# EAGLE design carte imprimante2 (EAGLE 6.1)
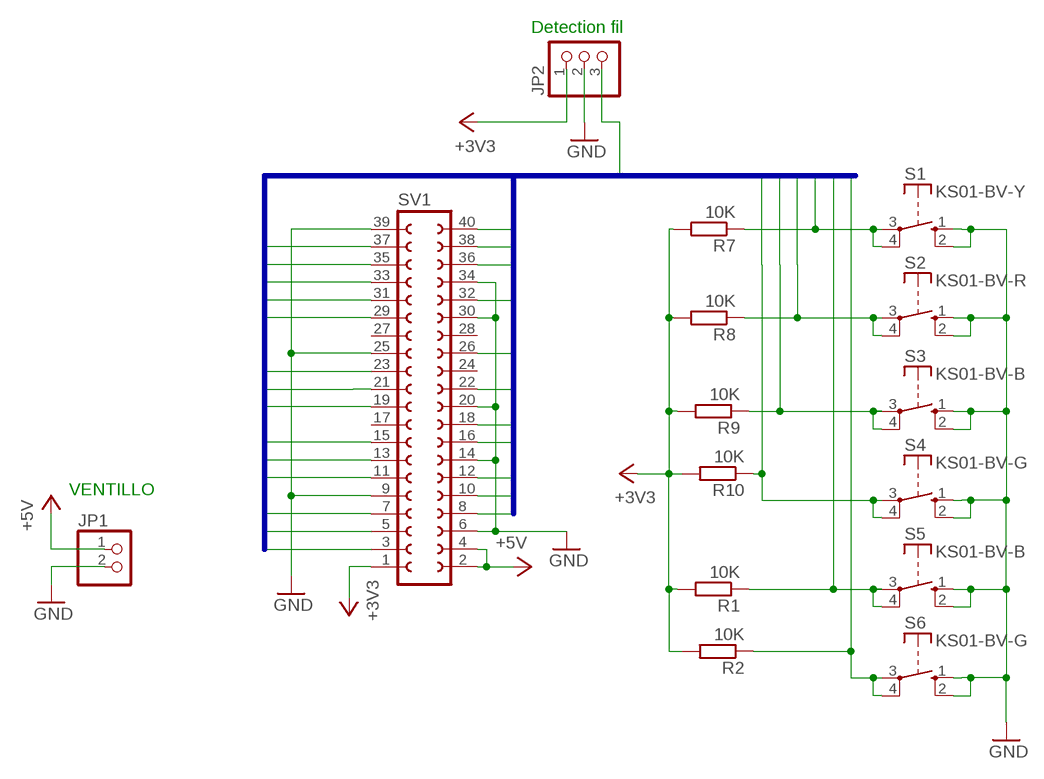
[diagram p0: schematic, sheet 1]

## Parts
JP1  PINHD-1X02_2.54-S  [1X02-S]
JP2  PINHD-1X3  [1X03]
R1  10K  R-EU_R0603  [R0603]
R2  10K  R-EU_R0603  [R0603]
R7  10K  R-EU_R0603  [R0603]
R8  10K  R-EU_R0603  [R0603]
R9  10K  R-EU_R0603  [R0603]
R10  10K  R-EU_R0603  [R0603]
S1  KS01-BV-Y  DT6  [DT6]
S2  KS01-BV-R  DT6  [DT6]
S3  KS01-BV-B  DT6  [DT6]
S4  KS01-BV-G  DT6  [DT6]
S5  KS01-BV-B  DT6  [DT6]
S6  KS01-BV-G  DT6  [DT6]
SV1  FE20-2  [FE20-2]

## Nets
+3V3: JP2.1 R1.2 R2.2 R7.2 R8.2 R9.2 R10.2 SV1.1
+5V: JP1.1 SV1.2 SV1.4
GND: JP1.2 JP2.2 S1.1(S) S1.2(S) S2.1(S) S2.2(S) S3.1(S) S3.2(S) S4.1(S) S4.2(S) S5.1(S) S5.2(S) S6.1(S) S6.2(S) SV1.6 SV1.9 SV1.14 SV1.20 SV1.25 SV1.30 SV1.34 SV1.39
GPIO2*: SV1.3
GPIO3*: SV1.5
GPIO4: SV1.7
GPIO5: SV1.29
GPIO6: SV1.31
GPIO7*: SV1.26
GPIO9*: SV1.21
GPIO10*: R7.1 S1.3(P) S1.4(P) SV1.19
GPIO11*: SV1.23
GPIO12: SV1.32
GPIO13: SV1.33
GPIO14*: SV1.8
GPIO15*: SV1.10
GPIO16: SV1.36
GPIO17: R10.1 S4.3(P) S4.4(P) SV1.11
GPIO18: JP2.3 SV1.12
GPIO19: R1.1 S5.3(P) S5.4(P) SV1.35
GPIO20: SV1.38
GPIO21: SV1.40
GPIO22: R8.1 S2.3(P) S2.4(P) SV1.15
GPIO23: SV1.16
GPIO24: SV1.18
GPIO25: SV1.22
GPIO26: R2.1 S6.3(P) S6.4(P) SV1.37
GPIO27: R9.1 S3.3(P) S3.4(P) SV1.13
Unconnected: SV1.17 SV1.24 SV1.27 SV1.28

## Buses
GPIO4,GPIO14*,GPIO15*,GPIO17,GPIO18,GPIO27,GPIO22,GPIO23,GPIO24,GPIO10*,GPIO9*,GPIO25,GPIO11*,GPIO7*,ID_SD,ID_SC,GPIO5,GPIO6,GPIO13,GPIO19,GPIO26,GPIO2*,GPIO3*,GPIO21,GPIO20,GPIO16,GPIO12

## Notes on the sheet
- Detection fil
- VENTILLO

## Library data of the parts
JP1 = pinhead-2:PINHD-1X02: PIN HEADER
JP2 = pinhead:PINHD-1X3: PIN HEADER
R1 R2 R7-R10 = rcl:R-EU_: RESISTOR, European symbol
S1-S6 = switch-misc:DT: ITT SWITCH
SV1 = con-lsta:FE20-2: FEMALE HEADER

## Board
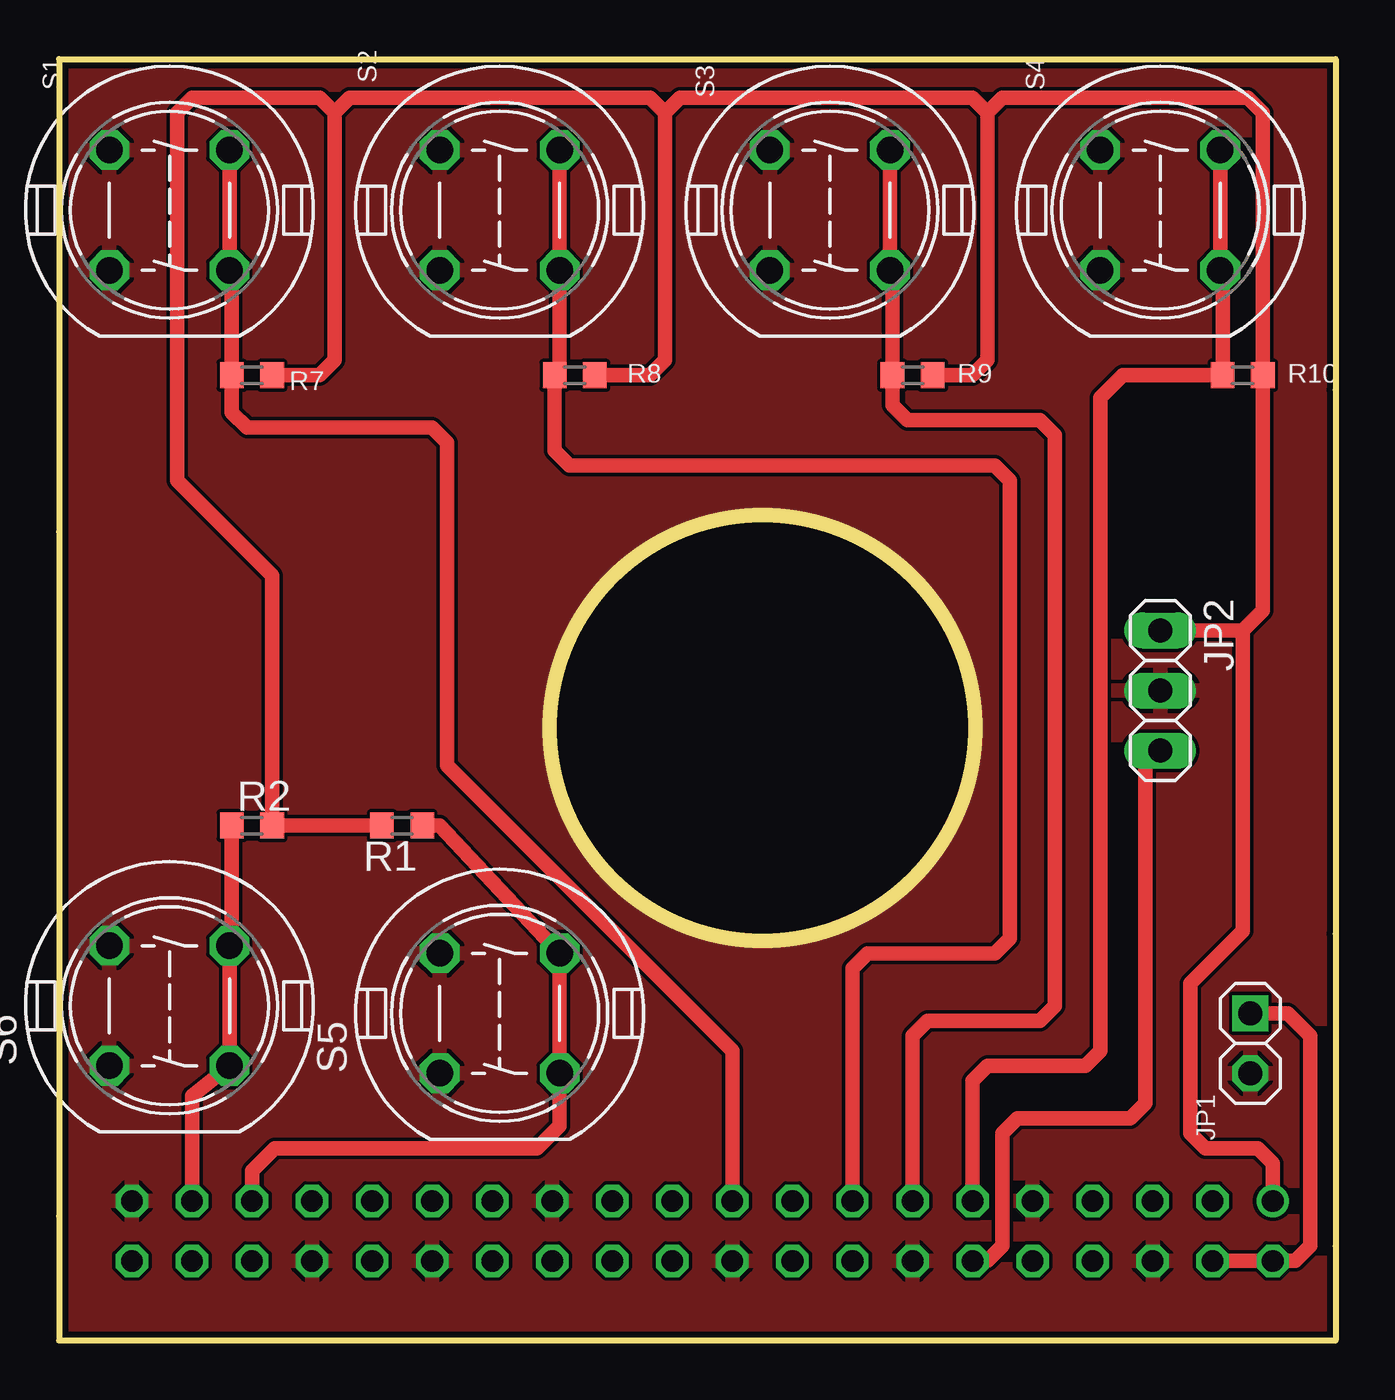
[diagram p1: board, top side]
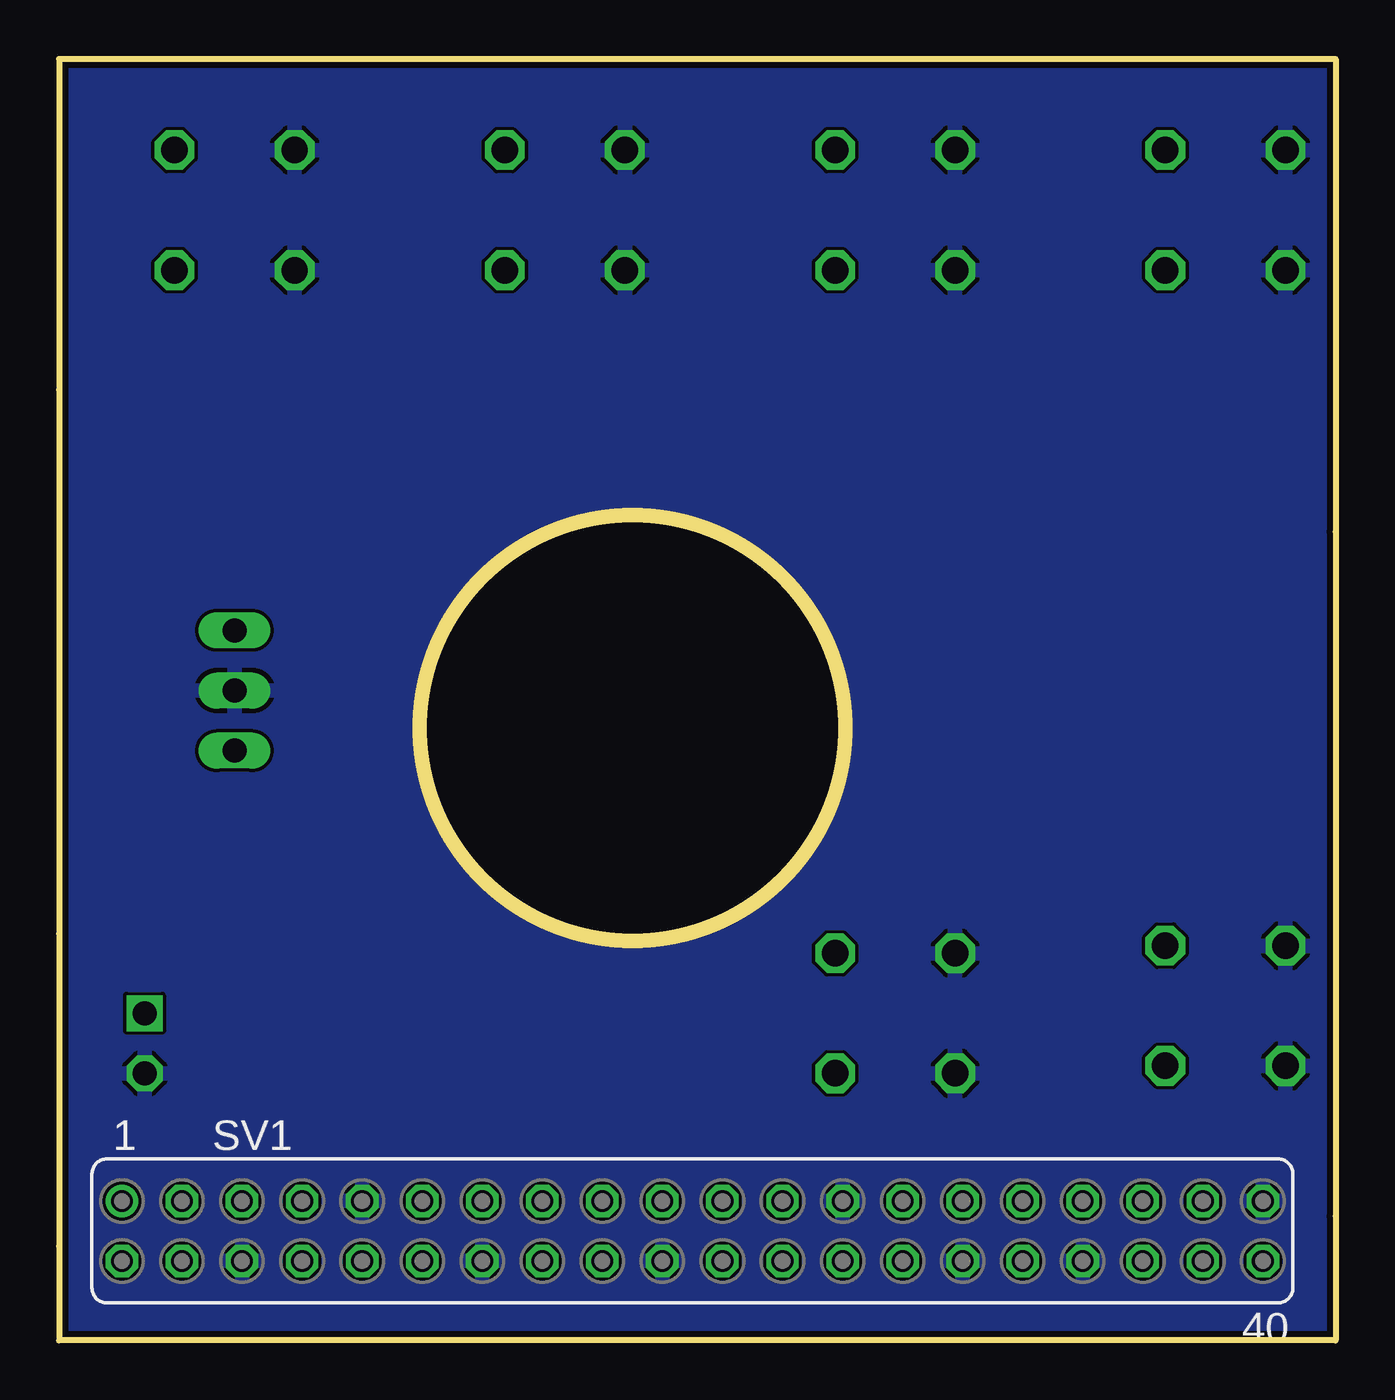
[diagram p2: board, bottom side, seen from below]

Size 54 x 54.2 mm. Coordinates in mm from the lower left corner, seen from the top.
Outline: 54,40.2 54,17.2 54,4 54,0 0,0 0,5.27 0,34.2 0,54.2 54,54.2 54,40.2
Copper layers (1*16): Top 0.018mm / dielectric 1.55mm / Bottom 0.018mm
Design rules: minimum track width 0.15mm, minimum drill 0.35mm, track to track 0.15mm, track to pad 0.15mm, pad to pad 0.15mm, via to via 0.15mm, smd to smd 0mil, copper to edge 0.25mm, drill to drill 0.35mm, minimum pad ring 0.175mm, minimum via ring 0.125mm, stop-mask expansion 0mil, vias tented up to drill 0.45mm, thermal gap 0.2mm
Holes 18 mm at 29.75,25.9
Milling: area 20.8,16.9 to 38.8,34.9; area 20.8,16.9 to 38.8,34.9

### Footprints (pad centres in the part's own frame; a part is rotated, then mirrored left to right if it is on the bottom)
1X02-S = drill 1.016 square: 1 -1.27,0 | drill 1.016 octagon: 2 1.27,0
1X03 = drill 1.016 long: 1 -2.54,0; 2 0,0; 3 2.54,0
R0603 = smd 1 x 1.1: 1 -0.85,0; 2 0.85,0
DT6 = drill 1.118 octagon: 1 -2.54,2.54; 2 2.54,2.54; 3 2.54,-2.54; 4 -2.54,-2.54
FE20-2 = drill 0.914: 1 -24.13,1.27 | drill 0.914 octagon: 2 -24.13,-1.27; 3 -21.59,1.27; 4 -21.59,-1.27; 5 -19.05,1.27; 6 -19.05,-1.27; 7 -16.51,1.27; 8 -16.51,-1.27; 9 -13.97,1.27; 10 -13.97,-1.27; 11 -11.43,1.27; 12 -11.43,-1.27; 13 -8.89,1.27; 14 -8.89,-1.27; 15 -6.35,1.27; 16 -6.35,-1.27; 17 -3.81,1.27; 18 -3.81,-1.27; 19 -1.27,1.27; 20 -1.27,-1.27; 21 1.27,1.27; 22 1.27,-1.27; 23 3.81,1.27; 24 3.81,-1.27; 25 6.35,1.27; 26 6.35,-1.27; 27 8.89,1.27; 28 8.89,-1.27; 29 11.43,1.27; 30 11.43,-1.27; 31 13.97,1.27; 32 13.97,-1.27; 33 16.51,1.27; 34 16.51,-1.27; 35 19.05,1.27; 36 19.05,-1.27; 37 21.59,1.27; 38 21.59,-1.27; 39 24.13,1.27; 40 24.13,-1.27

### Placement (x,y rotation side)
JP1  50.39,12.57 270 top
JP2  46.58,27.49 270 top
R1  14.51,21.77 180 top
R2  8.16,21.77 0 top
R7  8.16,40.83 0 top
R8  21.81,40.83 0 top
R9  36.1,40.83 0 top
R10  50.07,40.83 0 top
S1  4.67,47.81 90 top
S2  18.64,47.81 90 top
S3  32.61,47.81 90 top
S4  46.58,47.81 90 top
S5  18.64,13.84 90 top
S6  4.67,14.15 90 top
SV1  27.21,4.63 0 bottom

### Tracks (layer width: path | path; a pad name or v marks a point on that pad's centre or on a via)
+3V3
  Top 0.61: 39.27,51.94 39.91,52.57 50.28,52.57 50.92,51.94 R10.2 50.92,38.5 50.92,30.88 50.7,30.67 50.07,30.03 | 39.27,51.94 39.27,43.37 39.27,41.46 38.64,40.83 R9.2 | R8.2 24.99,40.83 25.62,41.46 25.62,50.35 25.62,51.94 | 25.62,51.94 26.26,52.57 36.73,52.57 38.64,52.57 39.27,51.94 | R7.2 11.02,40.83 11.65,41.46 11.65,49.72 11.65,51.94 | 11.65,51.94 12.29,52.57 23.4,52.57 24.99,52.57 25.62,51.94 | R1.2 R2.2 9.01,32.36 4.99,36.38 4.99,51.94 5.62,52.57 11.02,52.57 11.65,51.94 | SV1.1 51.34,7.49 50.7,8.12 50.07,8.12 48.48,8.12 47.85,8.76 47.85,15.11 49.75,17.01 50.07,17.33 50.07,30.03 | JP2.1 50.07,30.03
+5V
  Top 0.61: SV1.4 SV1.2 52.29,3.36 52.93,4 52.93,4.95 52.93,12.88 52.61,13.2 51.98,13.84 JP1.1
GND
  pour Bottom: -7.08,56.7 60.87,56.7 61.5,-1.4 -6.45,-1.4
  pour Top: -7.08,56.7 60.87,56.7 60.87,-1.08 -7.08,-1.08
GPIO10*
  Top 0.61: S1.3 S1.4 7.31,45.17 R7.1 7.31,39.24 7.95,38.6 8.79,38.6 15.78,38.6 16.41,37.97 16.41,24.31 28.48,12.25 SV1.19
GPIO17
  Top 0.61: SV1.11 38.64,10.98 39.27,11.61 43.4,11.61 44.04,12.25 44.04,17.33 44.04,39.87 44.99,40.83 R10.1 49.22,45.17 S4.4 S4.3
GPIO18
  Top 0.61: SV1.12 39.27,3.36 39.91,4 39.91,8.12 39.91,8.76 40.55,9.39 44.35,9.39 45.31,9.39 45.94,10.03 45.94,12.57 45.94,24.31 JP2.3
GPIO19
  Top 0.61: SV1.35 8.16,7.17 9.11,8.12 20.23,8.12 21.18,9.07 S5.4 S5.3 16.1,21.77 R1.1
GPIO22
  Top 0.61: S2.3 S2.4 21.18,41.14 20.86,40.83 R8.1 20.96,37.65 21.6,37.02 37.69,37.02 39.59,37.02 40.23,36.38 40.23,29.71 40.23,17.01 39.59,16.38 35.47,16.38 34.2,16.38 33.56,15.74 SV1.15
GPIO26
  Top 0.61: SV1.37 5.62,10.34 S6.4 S6.3 7.31,17.11 R2.1
GPIO27
  Top 0.61: S3.3 S3.4 35.25,45.17 R9.1 35.25,39.55 35.88,38.92 36.73,38.92 41.5,38.92 42.13,38.29 42.13,17.65 42.13,14.15 41.5,13.52 38.96,13.52 36.73,13.52 36.1,12.88 SV1.13